# Altium schematic sheet NRF52840-Beacon-V1-1.SchDoc
size B; SheetNumber: 1; SheetTotal: 1
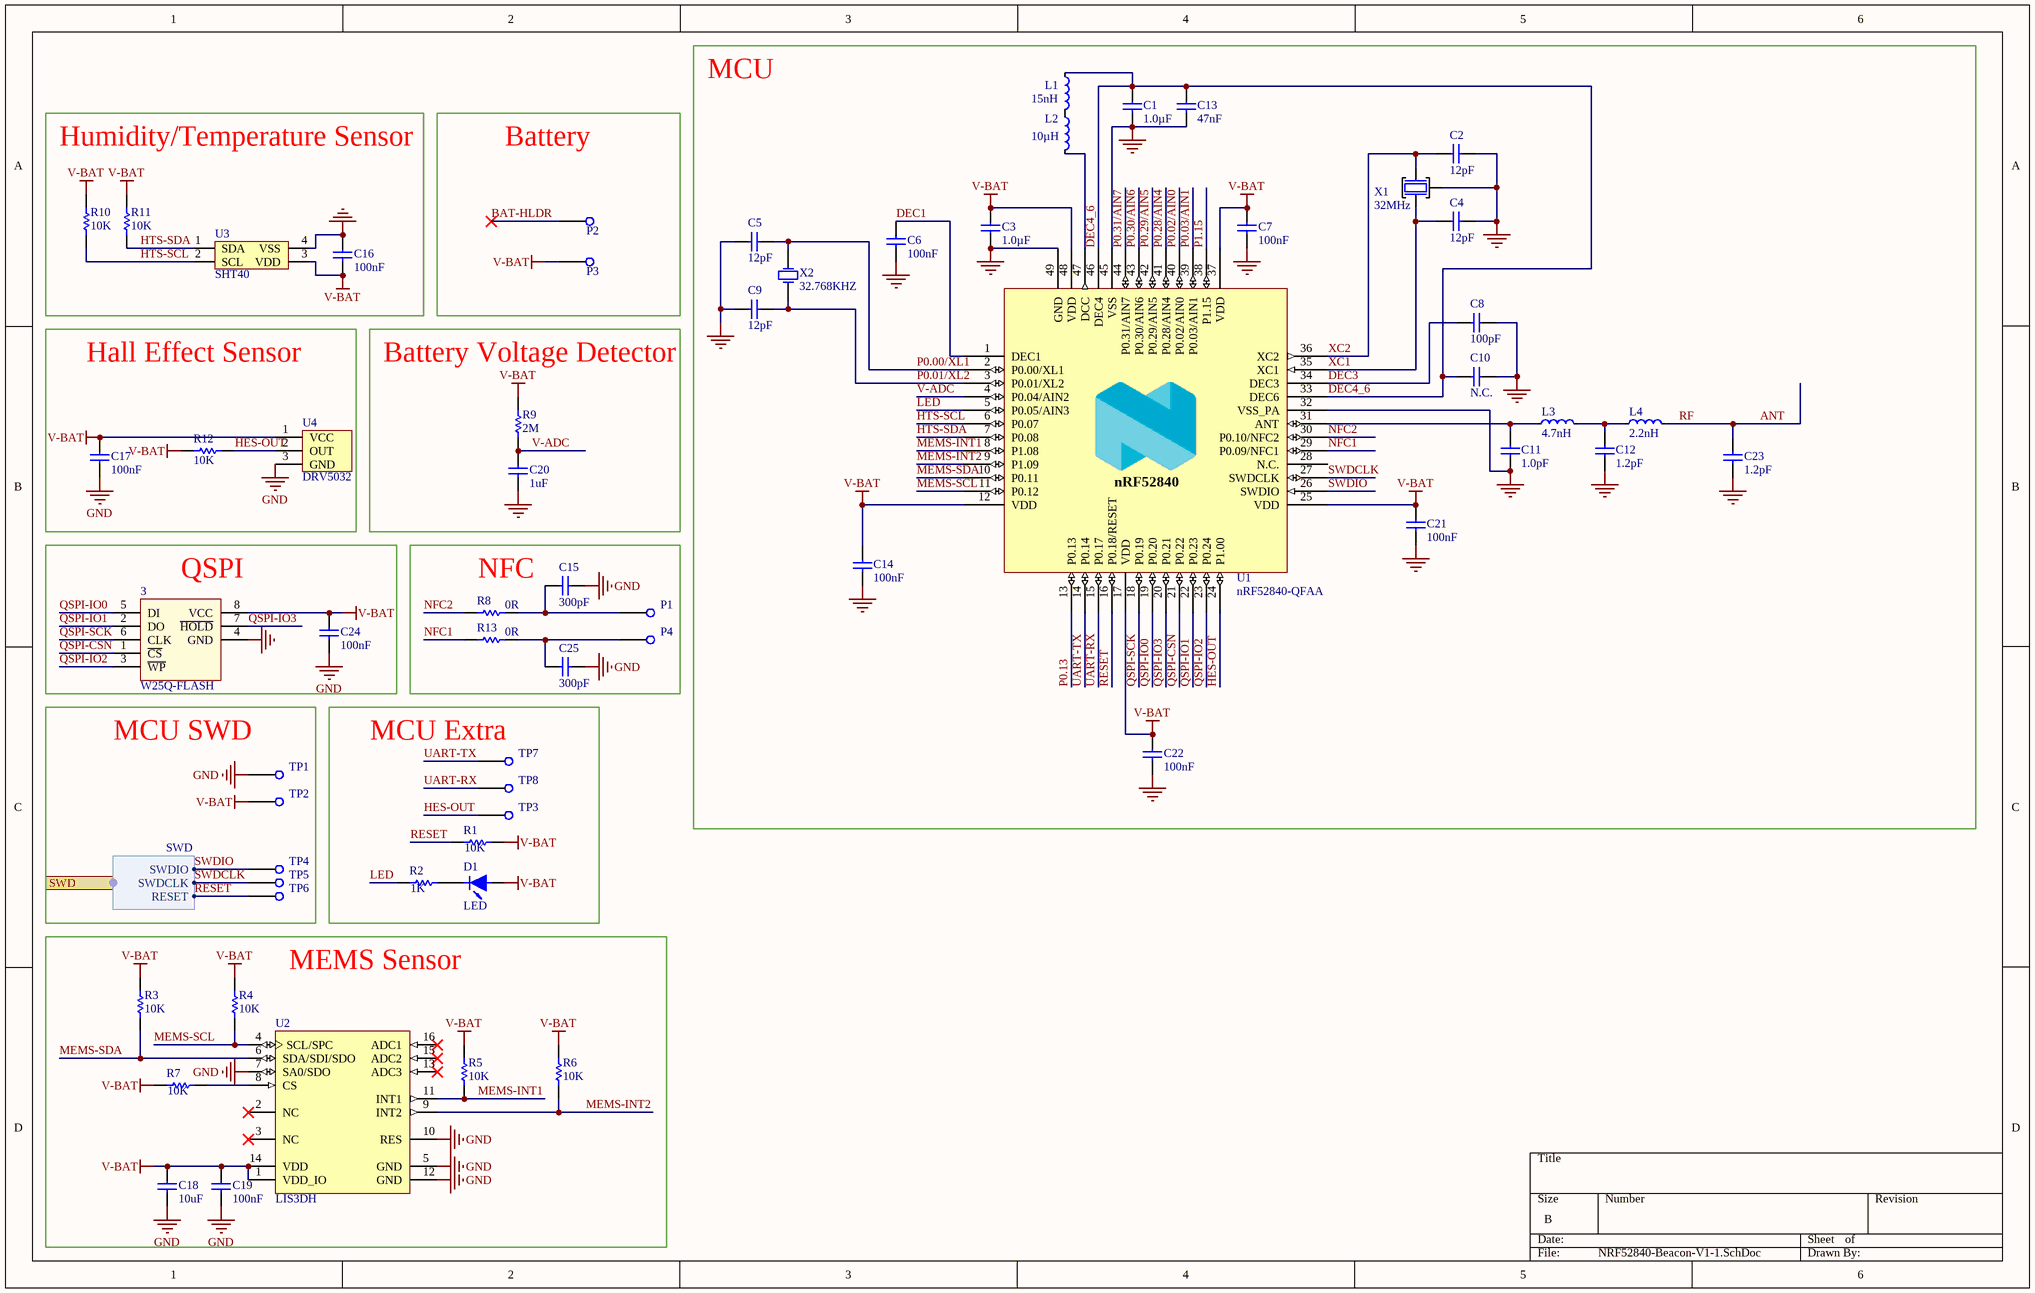
[diagram p0: NRF52840-Beacon-V1-1.SchDoc]

## Parts
3  W25Q-FLASH  [SO8W_M]
C1  1.0µF  [CAPC1608N]
C2  12pF  [CAPC1608N]
C3  1.0µF  [CAPC1608N]
C4  12pF  [CAPC1608N]
C5  12pF  [CAPC1608N]
C6  100nF  [CAPC1608N]
C7  100nF  [CAPC1608N]
C8  100pF  [CAPC1608N]
C9  12pF  [CAPC1608N]
C10  N.C.  [CAPC1608N]
C11  1.0pF  [CAPC1608N]
C12  1.2pF  [CAPC1608N]
C13  47nF  [CAPC1608N]
C14  100nF  [CAPC1608N]
C15  300pF  [CAPC1608N]
C16  100nF  [CAPC1608N]
C17  100nF  [CAPC1608N]
C18  10uF  [CAPC1608N]
C19  100nF  [CAPC1608N]
C20  1uF  [CAPC1608N]
C21  100nF  [CAPC1608N]
C22  100nF  [CAPC1608N]
C23  1.2pF  [CAPC1608N]
C24  100nF  [CAPC1608N]
C25  300pF  [CAPC1608N]
D1  LED  [LED_0603]
L1  15nH  [INDC1608N]
L2  10µH  [INDC1608N]
L3  4.7nH  [INDC1608N]
L4  2.2nH  [INDC1608N]
P1  PIN  [PIN]  (value not drawn)
P2  PIN  [PIN]  (value not drawn)
P3  PIN  [PIN]  (value not drawn)
P4  PIN  [PIN]  (value not drawn)
R1  10K  [RESC1608N]
R2  1K  [RESC1608N]
R3  10K  [RESC1608N]
R4  10K  [RESC1608N]
R5  10K  [RESC1608N]
R6  10K  [RESC1608N]
R7  10K  [RESC1608N]
R8  0R  [RESC1608N]
R9  2M  [RESC1608N]
R10  10K  [RESC1608N]
R11  10K  [RESC1608N]
R12  10K  [RESC1608N]
R13  0R  [RESC1608N]
TP1  PIN  [PIN]  (value not drawn)
TP2  PIN  [PIN]  (value not drawn)
TP3  PIN  [PIN]  (value not drawn)
TP4  PIN  [PIN]  (value not drawn)
TP5  PIN  [PIN]  (value not drawn)
TP6  PIN  [PIN]  (value not drawn)
TP7  PIN  [PIN]  (value not drawn)
TP8  PIN  [PIN]  (value not drawn)
U1  nRF52840-QFAA  [QFN40P600X600X90-48N]
U2  LIS3DH  [LGA-16]
U3  SHT40  [SHT40]
U4  DRV5032  [SOT-23]
X1  32MHz  [CRYSTAL_2016_NT]
X2  32.768KHZ  [CRYSTAL_3215]

## Blocks framed on the sheet
MCU: C1-C14 C21-C23 L1-L4 U1 X1 X2
Humidity/Temperature Sensor: C16 R10 R11 U3
Battery: P2 P3
Hall Effect Sensor: C17 R12 U4
Battery Voltage Detector: C20 R9
QSPI: 3 C24
NFC: C15 C25 P1 P4 R8 R13
MCU SWD: TP1 TP2 TP4-TP6
MCU Extra: D1 R1 R2 TP3 TP7 TP8
MEMS Sensor: C18 C19 R3-R7 U2

## Ports
SWD (harness SWD)

## Harnesses
SWD: SWDIO, SWDCLK, RESET

## Nets
GND: 3.4(GND) C1.1 C2.2 C3.2 C4.2 C5.2 C6.2 C7.2 C8.2 C9.2 C10.1 C11.1 C12.1 C13.2 C14.2 C15.2 C16.1 C17.2 C18.2 C19.2 C20.2 C21.2 C22.2 C23.2 C24.2 C25.2 TP1.1(PIN) U1.32(VSS_PA) U1.45(VSS) U1.49(GND) U2.5(GND) U2.7(SA0/SDO) U2.10(RES) U2.12(GND) U3.4(VSS) U4.3(GND) X1.2(GND)
V-BAT: 3.8(VCC) C3.1 C7.1 C14.1 C16.2 C17.1 C18.1 C19.1 C21.1 C22.1 C24.1 D1.1(A) P3.1(PIN) R1.2 R3.1 R4.1 R5.1 R6.1 R7.1 R9.2 R10.1 R11.1 R12.1 TP2.1(PIN) U1.12(VDD) U1.17(VDD) U1.25(VDD) U1.37(VDD) U1.48(VDD) U2.1(VDD_IO) U2.14(VDD) U3.3(VDD) U4.1(VCC)
ANT: C23.1 L4.2  [also labelled RF]
BAT-HLDR: P2.1(PIN)
DEC1: C6.1 U1.1(DEC1)
DEC3: C8.1 U1.34(DEC3)
DEC4_6: C1.2 C10.2 C13.1 L1.1 U1.33(DEC6) U1.46(DEC4)
HES-OUT: R12.2 TP3.1(PIN) U1.24(P1.00) U4.2(OUT)
HTS-SCL: R10.2 U1.6(P0.07) U3.2(SCL)
HTS-SDA: R11.2 U1.7(P0.08) U3.1(SDA)
LED: R2.1 U1.5(P0.05/AIN3)
MEMS-INT1: R5.2 U1.8(P1.08) U2.11(INT1)
MEMS-INT2: R6.2 U1.9(P1.09) U2.9(INT2)
MEMS-SCL: R4.2 U1.11(P0.12) U2.4(SCL/SPC)
MEMS-SDA: R3.2 U1.10(P0.11) U2.6(SDA/SDI/SDO)
NFC1: R13.2 U1.29(P0.09/NFC1)
NFC2: R8.2 U1.30(P0.10/NFC2)
P0.00/XL1: C5.1 U1.2(P0.00/XL1) X2.2(OSC2)
P0.01/XL2: C9.1 U1.3(P0.01/XL2) X2.1(OSC1)
P0.02/AIN0: U1.40(P0.02/AIN0)
P0.03/AIN1: U1.39(P0.03/AIN1)
P0.13: U1.13(P0.13)
P0.28/AIN4: U1.41(P0.28/AIN4)
P0.29/AIN5: U1.42(P0.29/AIN5)
P0.30/AIN6: U1.43(P0.30/AIN6)
P0.31/AIN7: U1.44(P0.31/AIN7)
P1.15: U1.38(P1.15)
QSPI-CSN: 3.1(~{CS}) U1.21(P0.22)
QSPI-IO0: 3.5(DI) U1.19(P0.20)
QSPI-IO1: 3.2(DO) U1.22(P0.23)
QSPI-IO2: 3.3(~{WP}) U1.23(P0.24)
QSPI-IO3: 3.7(~{HOLD}) U1.20(P0.21)
QSPI-SCK: 3.6(CLK) U1.18(P0.19)
RESET: R1.1 TP6.1(PIN) U1.16(P0.18/RESET) ; port SWD.RESET
SWDCLK: TP5.1(PIN) U1.27(SWDCLK) ; port SWD.SWDCLK
SWDIO: TP4.1(PIN) U1.26(SWDIO) ; port SWD.SWDIO
UART-RX: TP8.1(PIN) U1.15(P0.17)
UART-TX: TP7.1(PIN) U1.14(P0.14)
V-ADC: C20.1 R9.1 U1.4(P0.04/AIN2)
XC1: C4.1 U1.35(XC1) X1.1(IN)
XC2: C2.1 U1.36(XC2) X1.3(OUT)
NetC11_2: C11.2 L3.1 U1.31(ANT)
NetC12_2: C12.2 L3.2 L4.1
NetC15_1: C15.1 P1.1(PIN) R8.1
NetC25_1: C25.1 P4.1(PIN) R13.1
NetD1_2: D1.2(K) R2.2
NetL1_2: L1.2 L2.1
NetL2_2: L2.2 U1.47(DCC)
NetR7_2: R7.2 U2.8(CS)

Not connected (* = marked no-connect by the designer): U1 28(N.C.); U2 2(NC)* 3(NC)* 13(ADC3)* 15(ADC2)* 16(ADC1)*

## Notes on the sheet
- (in symbol nRF52840-QFAA) nRF52840

## Library data of the parts
C1 C3 = C0402-1µ0: Capacitor, X5R, ±10%; Pad Count: 2; Part Number: C0402-1µ0; LatestRevisionDate: 2016-08-22; Published: 2009-05-08; Value: 1.0µF; Footprint Doc: 0402; Component Class: Capacitors
C2 C4 C5 C9 C15-C20 C24 C25 = C0201-12p: Capacitor, NP0, ±2%; Pad Count: 2; Part Number: C0201-12p; LatestRevisionDate: 2017-11-09; Published: 2014-11-13; Footprint Doc: 0201; Component Class: Capacitors
  C2 C4 C5 C9: Value: 12pF
  C15 C25: Value: 300pF
  C16 C17 C19 C24: Value: 100nF
  C18: Value: 10uF
  C20: Value: 1uF
C6 C7 C14 C21 C22 = C0201-100n: Capacitor, X5R, ±10%; Pad Count: 2; Part Number: C0201-100n; LatestRevisionDate: 2017-11-09; Published: 2014-11-13; Value: 100nF; Footprint Doc: 0201; Component Class: Capacitors
C8 = C0201-100p: Capacitor, NP0, ±5%; Pad Count: 2; Part Number: C0201-100p; LatestRevisionDate: 2019-04-16; Published: 2019-04-16; Value: 100pF; Footprint Doc: 0201; Component Class: Capacitors
C10 = C0201-N.C.: Not mounted; Assembly: Not mounted; Pad Count: 2; Part Number: C0201-N.C.; LatestRevisionDate: 2014-11-13; Published: 2014-11-13; Value: N.C.; Footprint Doc: 0201; Component Class: Capacitors
C11 = C0201-1.0p: Capacitor, NP0, ±10%; Pad Count: 2; Part Number: C0201-1.0p; LatestRevisionDate: 2018-10-22; Published: 2014-11-13; Value: 1.0pF; Footprint Doc: 0201; Component Class: Capacitors
C12 C23 = C0201-1.2p: Capacitor, NP0, ±10%; Pad Count: 2; Part Number: C0201-1.2p; LatestRevisionDate: 2020-10-13; Published: 2014-11-13; Value: 1.2pF; Footprint Doc: 0201; Component Class: Capacitors
C13 = C0201-47n: Capacitor, X5R, ±10%; Pad Count: 2; Part Number: C0201-47n; LatestRevisionDate: 2017-11-09; Published: 2014-11-13; Value: 47nF; Footprint Doc: 0201; Component Class: Capacitors
L1 = L0402-15n: High frequency chip inductor ±10%; Pad Count: 2; Part Number: L0402-15n; LatestRevisionDate: 2012-09-19; Published: 2010-07-12; Value: 15nH; Footprint Doc: 0402; Component Class: Inductors
L2 = L0603-10µ-TDK: Chip inductor, IDC,min = 50 mA, ±20%; Pad Count: 2; Part Number: L0603-10µ-TDK; LatestRevisionDate: 2012-09-19; Published: 2019-05-06; Value: 10µH; Footprint Doc: 0603; Component Class: Inductors
L3 = L0201-4n7: High frequency chip inductor ±5%; Pad Count: 2; Part Number: L0201-4n7; LatestRevisionDate: 2013-04-10; Published: 2013-04-10; Value: 4.7nH; Footprint Doc: 0201; Component Class: Inductors
L4 = L0201-2n2: High frequency chip inductor ±5%; Pad Count: 2; Part Number: L0201-2n2; LatestRevisionDate: 2013-04-10; Published: 2013-04-10; Value: 2.2nH; Footprint Doc: 0201; Component Class: Inductors
R1-R13 = Resistor
U1 = nRF52840-QFAA: Multi-protocol Bluetooth Low Energy, IEEE 802.15.4, ANT and 2.4GHz proprietary system-on-chip; Pad Count: 48; Part Number: nRF52840-QFAA; LatestRevisionDate: 2016-11-22; Published: 2016-03-31; Value: nRF52840-QFAA; Footprint Doc: QFN-48; Component Class: nRF_Devices
U2 = LIS3DH: MEMS Digital Output Motion Sensor Ultra Low-Power High Performance 3-Axes "nano" Accelerometer, 1.71 to 3.6 V, -40 to 85 degC, 16-pin (LGA-16), Pb-Free, Tray; Manufacturer: STMicroelectronics; Interface: I2C, SPI; Current Consumption in Power-Down mode: 0.5 uA; Bandwidth: 5 kHz; ComponentLink1Description: Manufacturer URL; ComponentLink1URL: http://www.st.com/; Output Type: Digital; ComponentLink3Description: Package Specification; ComponentLink3URL: http://www.st.com/st-web-ui/static/active/en/resource/technical/document/datasheet/CD00274221.pdf; PackageReference: LGA-16; Wide Supply Voltage: 1.71 to 3.6 V; PackageDescription: 16-Pin Land Grid Array, Body 3 x 3 mm, Pitch 0.5 mm; PartNumber: LIS3DH; ComponentLink2URL: http://www.st.com/st-web-ui/static/active/en/resource/technical/document/datasheet/CD00274221.pdf; RoHS: TRUE; Operating Temperature: -40 to 85 degC; DatasheetVersion: Rev. 1; Mounting Technology: Surface Mount; Packing: Tray; ComponentLink2Description: Datasheet
U3 = SHT40: High-Accuracy, Ultra-Low-Power, 16-bit, Relative Humidity and Temperature Sensor
U4 = Hall_Effect_Sensor_Switch: ultra-low-power digital-switch Hall effect sensor
X1 = XTAL_SMD2016_32MHz_8pF_General_NT: XTAL SMD 2016, 32MHz, Cl=8pF, Total Tol: ±30ppm; Pad Count: 4; Part Number: XTAL_SMD2016_32MHz_8pF_General_NT; LatestRevisionDate: 2021-04-08; Published: 2021-04-08; Value: 32MHz; Footprint Doc: XTAL_2016; Component Class: Oscillators
X2 = Crystal_Oscillator_2PIN
D1 = LED: Published: 8-Jun-2000; LatestRevisionDate: 17-Dec-2003; LatestRevisionNote: PCB Footprint replaced.; DatasheetVersion: 16-Apr-2002; PackageVersion: 16-Apr-2002; PackageReference: 3.5X2.8X1.9; Publisher: Altium Limited